# Altium schematic sheet 222.SchDoc
size A4
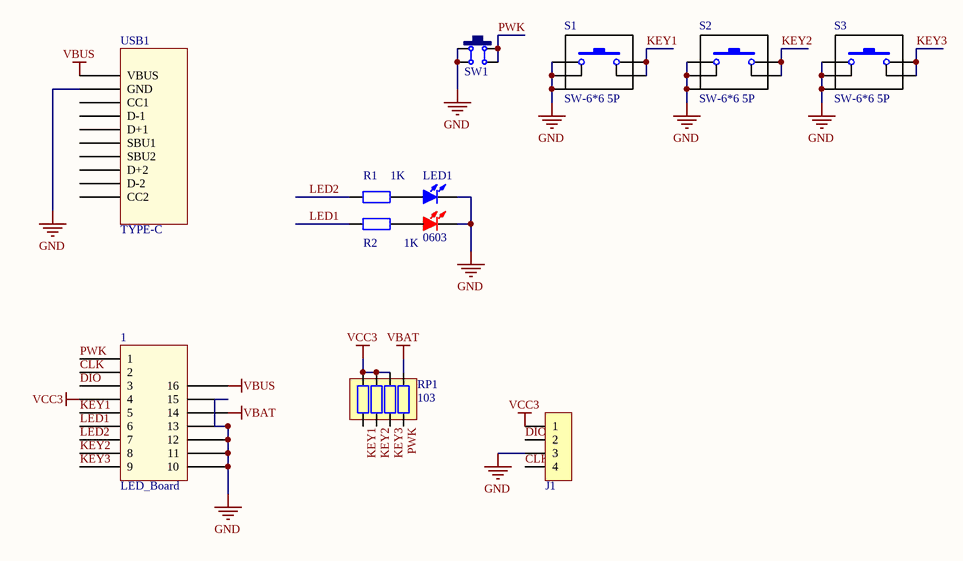
[diagram p0: 222.SchDoc]

## Parts
1  LED_Board  [LED_PAD]
J1  HDR-1X4  [HDR2.0-LI-4P]  (value not drawn)
LED1  0603  [LED 0603-RG]
R1  1K  [R 0402_M]
R2  1K  [R 0402_M]
RP1  103  [RCA-8P4R-0402]
S1  SW-6*6 5P  [SW6*6]
S2  SW-6*6 5P  [SW6*6]
S3  SW-6*6 5P  [SW6*6]
SW1  4x4x0.8  [TS-027A]  (value not drawn)
USB1  TYPE-C  [TYPE-C]

## Nets
GND: 1.10 1.11 1.12 1.13 1.15 J1.3 LED1.3 LED1.4 S1.1 S1.4 S1.5 S2.1 S2.4 S2.5 S3.1 S3.4 S3.5 SW1.1 SW1.4 USB1.GND
VBAT: 1.14 RP1.5
VBUS: 1.16 USB1.VBUS
VCC3: 1.4 J1.1 RP1.6 RP1.7 RP1.8
CLK: 1.2 J1.4
DIO: 1.3 J1.2
KEY1: 1.5 RP1.1 S1.2 S1.3
KEY2: 1.8 RP1.2 S2.2 S2.3
KEY3: 1.9 RP1.3 S3.2 S3.3
LED1: 1.6 R2.1
LED2: 1.7 R1.1
PWK: 1.1 RP1.4 SW1.2 SW1.3
NetLED1_1: LED1.1 R1.2
NetLED1_2: LED1.2 R2.2

Not connected (* = marked no-connect by the designer): USB1 CC1 D+1 D+2 D-1 D-2 SBU1 SBU2

## Library data of the parts
J1 = Header 4: 4P接插件; 版权归属: 源创客; BOM名称: 4P接插件; 学习资源: www.ooocke.com
LED1 = LED-SMD-RG: 贴片双色LED; 版权归属: 源创客; BOM名称: 贴片双色LED; 学习资源: www.ooocke.com
R1 R2 = R: 贴片电阻; 版权归属: 源创客; BOM名称: 贴片电阻; 学习资源: www.ooocke.com
RP1 = R-8P4R: 贴片网络排阻; 版权归属: 源创客; BOM名称: 贴片网络排阻; 学习资源: www.ooocke.com
S1-S3 = SW-6*6 5P: 微动开关; Published: 24-Mar-1999; LatestRevisionDate: 17-Jul-2002; LatestRevisionNote: Re-released for DXP Platform.; PackageReference: SPST-2; Publisher: Altium Limited
SW1 = TS-027A: 薄膜轻触开关; 版权归属: 源创客; BOM名称: 薄膜轻触开关; 学习资源: www.ooocke.com
USB1 = USB-C